# Altium project Power.PrjPcb
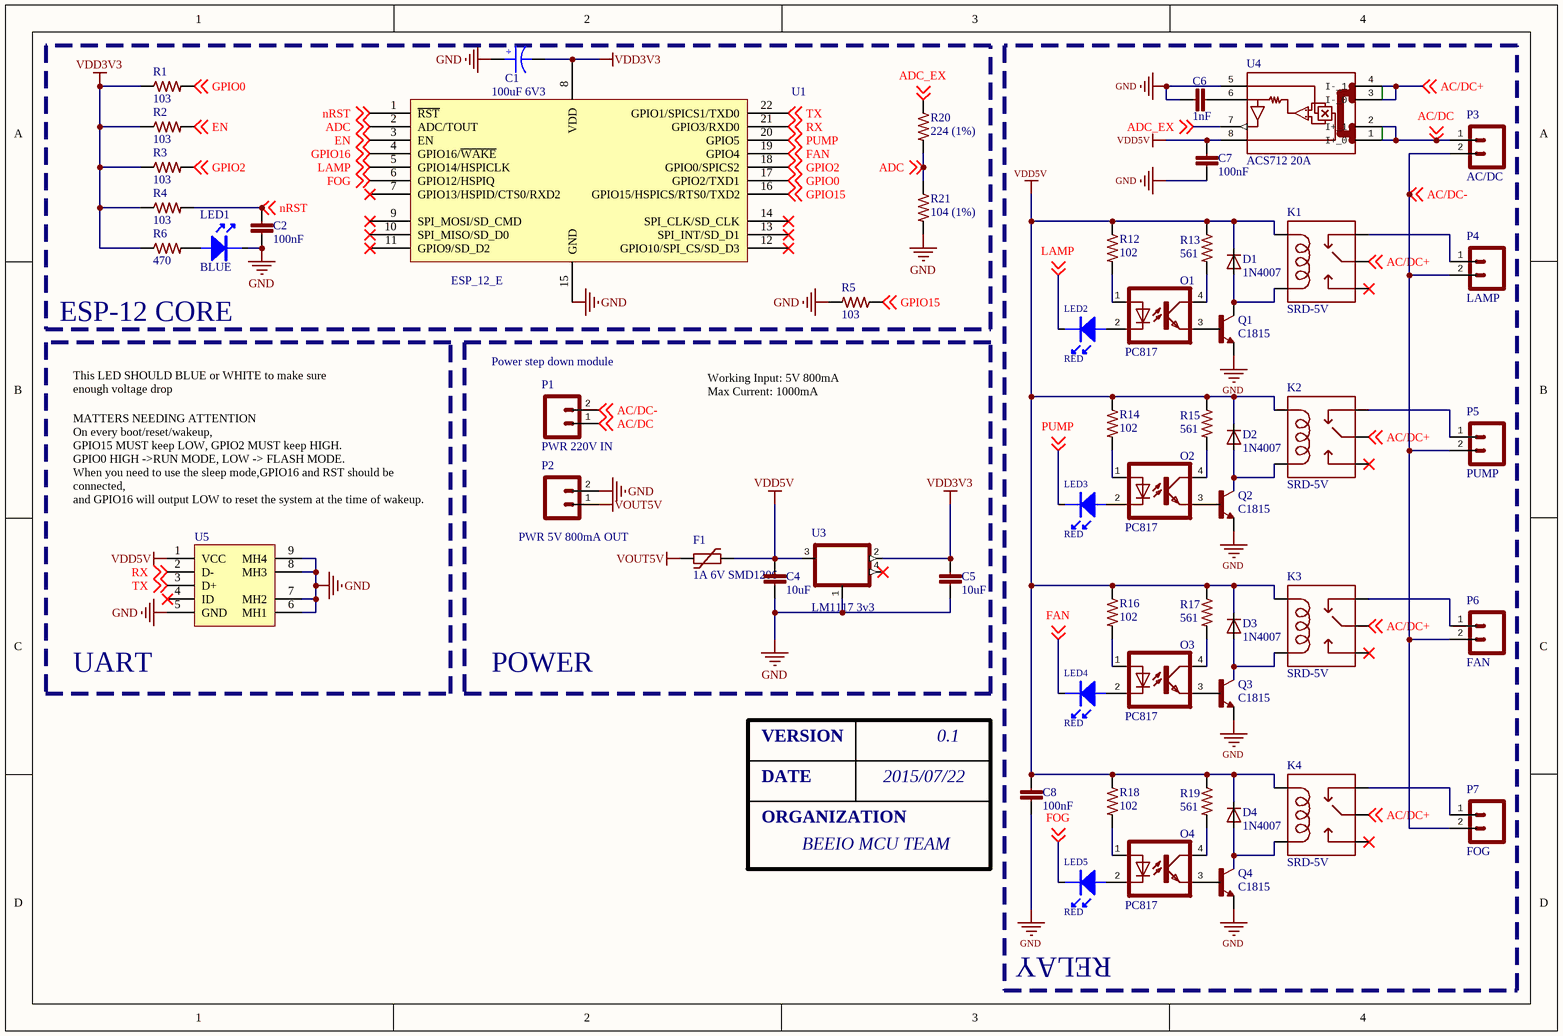
[diagram p0: Power.SchDoc]
1 sheet, 56 parts. Net scope: global (net labels, ports and power ports of the same name join across sheets).
Board file: Power.PcbDoc

## Sheet Power.SchDoc
size A4

### Parts
C1  100uF 6V3  [SMT_C_Tantalum_B]
C2  100nF  [0603]
C4  10uF  [0603]
C5  10uF  [0603]
C6  1nF  [0603]
C7  100nF  [0603]
C8  100nF  [0603]
D1  1N4007  [SMA-DIODE]
D2  1N4007  [SMA-DIODE]
D3  1N4007  [SMA-DIODE]
D4  1N4007  [SMA-DIODE]
F1  1A 6V SMD1206  [1206L]
K1  SRD-5V  [SRD-05VDC-SL-C]
K2  SRD-5V  [SRD-05VDC-SL-C]
K3  SRD-5V  [SRD-05VDC-SL-C]
K4  SRD-5V  [SRD-05VDC-SL-C]
LED1  BLUE  [SMT_LED_0603]
LED2  RED  [SMT_LED_0603]
LED3  RED  [SMT_LED_0603]
LED4  RED  [SMT_LED_0603]
LED5  RED  [SMT_LED_0603]
O1  PC817  [DIL4-SMD]
O2  PC817  [DIL4-SMD]
O3  PC817  [DIL4-SMD]
O4  PC817  [DIL4-SMD]
P1  PWR 220V IN  [SCREWTERMINAL-5MM-2]
P2  PWR 5V 800mA OUT  [SCREWTERMINAL-3.5MM-2]
P3  AC/DC  [SCREWTERMINAL-5MM-2]
P4  LAMP  [SCREWTERMINAL-5MM-2]
P5  PUMP  [SCREWTERMINAL-5MM-2]
P6  FAN  [SCREWTERMINAL-5MM-2]
P7  FOG  [SCREWTERMINAL-5MM-2]
Q1  C1815  [SOT23]
Q2  C1815  [SOT23]
Q3  C1815  [SOT23]
Q4  C1815  [SOT23]
R1  103  [0603]
R2  103  [0603]
R3  103  [0603]
R4  103  [0603]
R5  103  [0603]
R6  470  [0603]
R12  102  [0603]
R13  561  [0603]
R14  102  [0603]
R15  561  [0603]
R16  102  [0603]
R17  561  [0603]
R18  102  [0603]
R19  561  [0603]
R20  224 (1%)  [0603]
R21  104 (1%)  [0603]
U1  ESP_12_E  [ESP_12_E_L]
U3  LM1117 3v3  [SOT223]
U4  ACS712 20A  [SO08]
U5  Micro USB B 5S DIP  [USB_MICRO_5S_B]  (value not drawn)

### Blocks framed on the sheet
ESP-12 CORE: C1 C2 LED1 R1-R6 R20 R21 U1
RELAY: C6-C8 D1-D4 K1-K4 LED2-LED5 O1-O4 P3-P7 Q1-Q4 R12-R19 U4
POWER: C4 C5 F1 P1 P2 U3

### Nets
GND: C1.1 C2.2 C4.1 C5.1 C6.1 C7.1 C8.1 LED1.2(K) P2.2 Q1.2(E) Q2.2(E) Q3.2(E) Q4.2(E) R5.2 R21.2 U1.15(GND) U3.1(ADJ) U4.5(GND) U5.5(GND) U5.6(MH1) U5.7(MH2) U5.8(MH3) U5.9(MH4)
VDD3V3: C1.2 C5.2 R1.1 R2.1 R3.1 R4.1 R6.1 U1.8(VDD) U3.2(OUT)
VDD5V: C4.2 C7.2 C8.2 D1.C D2.C D3.C D4.C F1.P$2 K1.COIL1 K2.COIL1 K3.COIL1 K4.COIL1 R12.1 R13.1 R14.1 R15.1 R16.1 R17.1 R18.1 R19.1 U3.3(IN) U4.8(VCC) U5.1(VCC)
VOUT5V: F1.P$1 P2.1
AC/DC: P1.1 P3.1 U4.1(I+_0) U4.2(I+_1) ; off-sheet AC/DC
AC/DC+: K1.SWCOMMON K2.SWCOMMON K3.SWCOMMON K4.SWCOMMON U4.3(I-_0) U4.4(I-_1) ; off-sheet AC/DC+
AC/DC-: P1.2 P3.2 P4.2 P5.2 P6.2 P7.2 ; off-sheet AC/DC-
ADC: R20.2 R21.1 U1.2(ADC/TOUT) ; off-sheet ADC
ADC_EX: R20.1 U4.7(VOUT) ; off-sheet ADC_EX
EN: R2.2 U1.3(EN) ; off-sheet EN
FAN: LED4.2(K) U1.19(GPIO4) ; off-sheet FAN
FOG: LED5.2(K) U1.6(GPIO12/HSPIQ) ; off-sheet FOG
GPIO0: R1.2 U1.17(GPIO2/TXD1) ; off-sheet GPIO0
GPIO2: R3.2 U1.18(GPIO0/SPICS2) ; off-sheet GPIO2
GPIO15: R5.1 U1.16(GPIO15/HSPICS/RTS0/TXD2) ; off-sheet GPIO15
GPIO16: U1.4(GPIO16/~{WAKE}) ; off-sheet GPIO16
LAMP: LED2.2(K) U1.5(GPIO14/HSPICLK) ; off-sheet LAMP
nRST: C2.1 R4.2 U1.1(~{RST}) ; off-sheet nRST
PUMP: LED3.2(K) U1.20(GPIO5) ; off-sheet PUMP
RX: U1.21(GPIO3/RXD0) U5.2(D-) ; off-sheet RX
TX: U1.22(GPIO1/SPICS1/TXD0) U5.3(D+) ; off-sheet TX
NetC6_2: C6.2 U4.6(FILTER)
NetD1_A: D1.A K1.COIL0 Q1.3(C)
NetD2_A: D2.A K2.COIL0 Q2.3(C)
NetD3_A: D3.A K3.COIL0 Q3.3(C)
NetD4_A: D4.A K4.COIL0 Q4.3(C)
NetK1_SWCLOSED: K1.SWCLOSED(SWCLOSE) P4.1
NetK2_SWCLOSED: K2.SWCLOSED(SWCLOSE) P5.1
NetK3_SWCLOSED: K3.SWCLOSED(SWCLOSE) P6.1
NetK4_SWCLOSED: K4.SWCLOSED(SWCLOSE) P7.1
NetLED1_1: LED1.1(A) R6.2
NetLED2_1: LED2.1(A) O1.2(C)
NetLED3_1: LED3.1(A) O2.2(C)
NetLED4_1: LED4.1(A) O3.2(C)
NetLED5_1: LED5.1(A) O4.2(C)
NetO1_1: O1.1(A) R12.2
NetO1_3: O1.3(EMIT) Q1.1(B)
NetO1_4: O1.4(COL) R13.2
NetO2_1: O2.1(A) R14.2
NetO2_3: O2.3(EMIT) Q2.1(B)
NetO2_4: O2.4(COL) R15.2
NetO3_1: O3.1(A) R16.2
NetO3_3: O3.3(EMIT) Q3.1(B)
NetO3_4: O3.4(COL) R17.2
NetO4_1: O4.1(A) R18.2
NetO4_3: O4.3(EMIT) Q4.1(B)
NetO4_4: O4.4(COL) R19.2

Not connected (* = marked no-connect by the designer): K1 SWOPEN*; K2 SWOPEN*; K3 SWOPEN*; K4 SWOPEN*; U1 7(GPIO13/HSPID/CTS0/RXD2)* 9(SPI_MOSI/SD_CMD)* 10(SPI_MISO/SD_D0)* 11(GPIO9/SD_D2)* 12(GPIO10/SPI_CS/SD_D3)* 13(SPI_INT/SD_D1)* 14(SPI_CLK/SD_CLK)*; U3 4(OUT)*; U5 4(ID)*

### Notes on the sheet
- (near P1) Power step down module
- This LED SHOULD BLUE or WHITE to make sure enough voltage drop
- Working Input: 5V 800mA
  Max Current: 1000mA
- (near U5) MATTERS NEEDING ATTENTION
  On every boot/reset/wakeup,
  GPIO15 MUST keep LOW, GPIO2 MUST keep HIGH.
  GPIO0 HIGH ->RUN MODE, LOW -> FLASH MODE.
  When you need to use the sleep mode,GPIO16 and RST should be connected,
  and GPIO16 will output LOW to reset the system at the time of wakeup.
- UART
- DATE
- VERSION
- 2015/07/22
- 0.1
- ORGANIZATION
- BEEIO MCU TEAM
- (in symbol SMT_C_Tantalum_B) +

### Library data of the parts
C1 = SMT_C_Tantalum_B: Capacitor, SM Tantalum; Body 3.5 x 2.8 mm (LxW typ)
C2 C4-C8 = CAP0603
D1-D4 = DIODESMA
F1 = 1206L
K1-K4 = RELAYPTH
LED1-LED5 = SMT_LED_0603: SMT LED
O1-O4 = PC817: MPN: PC817X4J000F; OC_FARNELL: 9707727; OC_NEWARK: 97K7059
P1 P3-P7 = M025MM
P2 = M023.5MM
Q1-Q4 = TRANSISTOR_NPNSOT23
R1-R6 R12-R21 = RESISTOR0603
U1 = ESP_12_E: ESP-12 Wi-Fi Module by AI-Thinker; IC: ESP8266-EX; Vendor: Ai-thinker
U3 = V_REG_LM1117SOT223: PROD_ID: VREG-08170
U4 = ACS712
U5 = USB_Micro_5S_B: USB micro female SMT with 4 fixed foot